# Altium schematic sheet PushButtonRed.SchDoc
size B
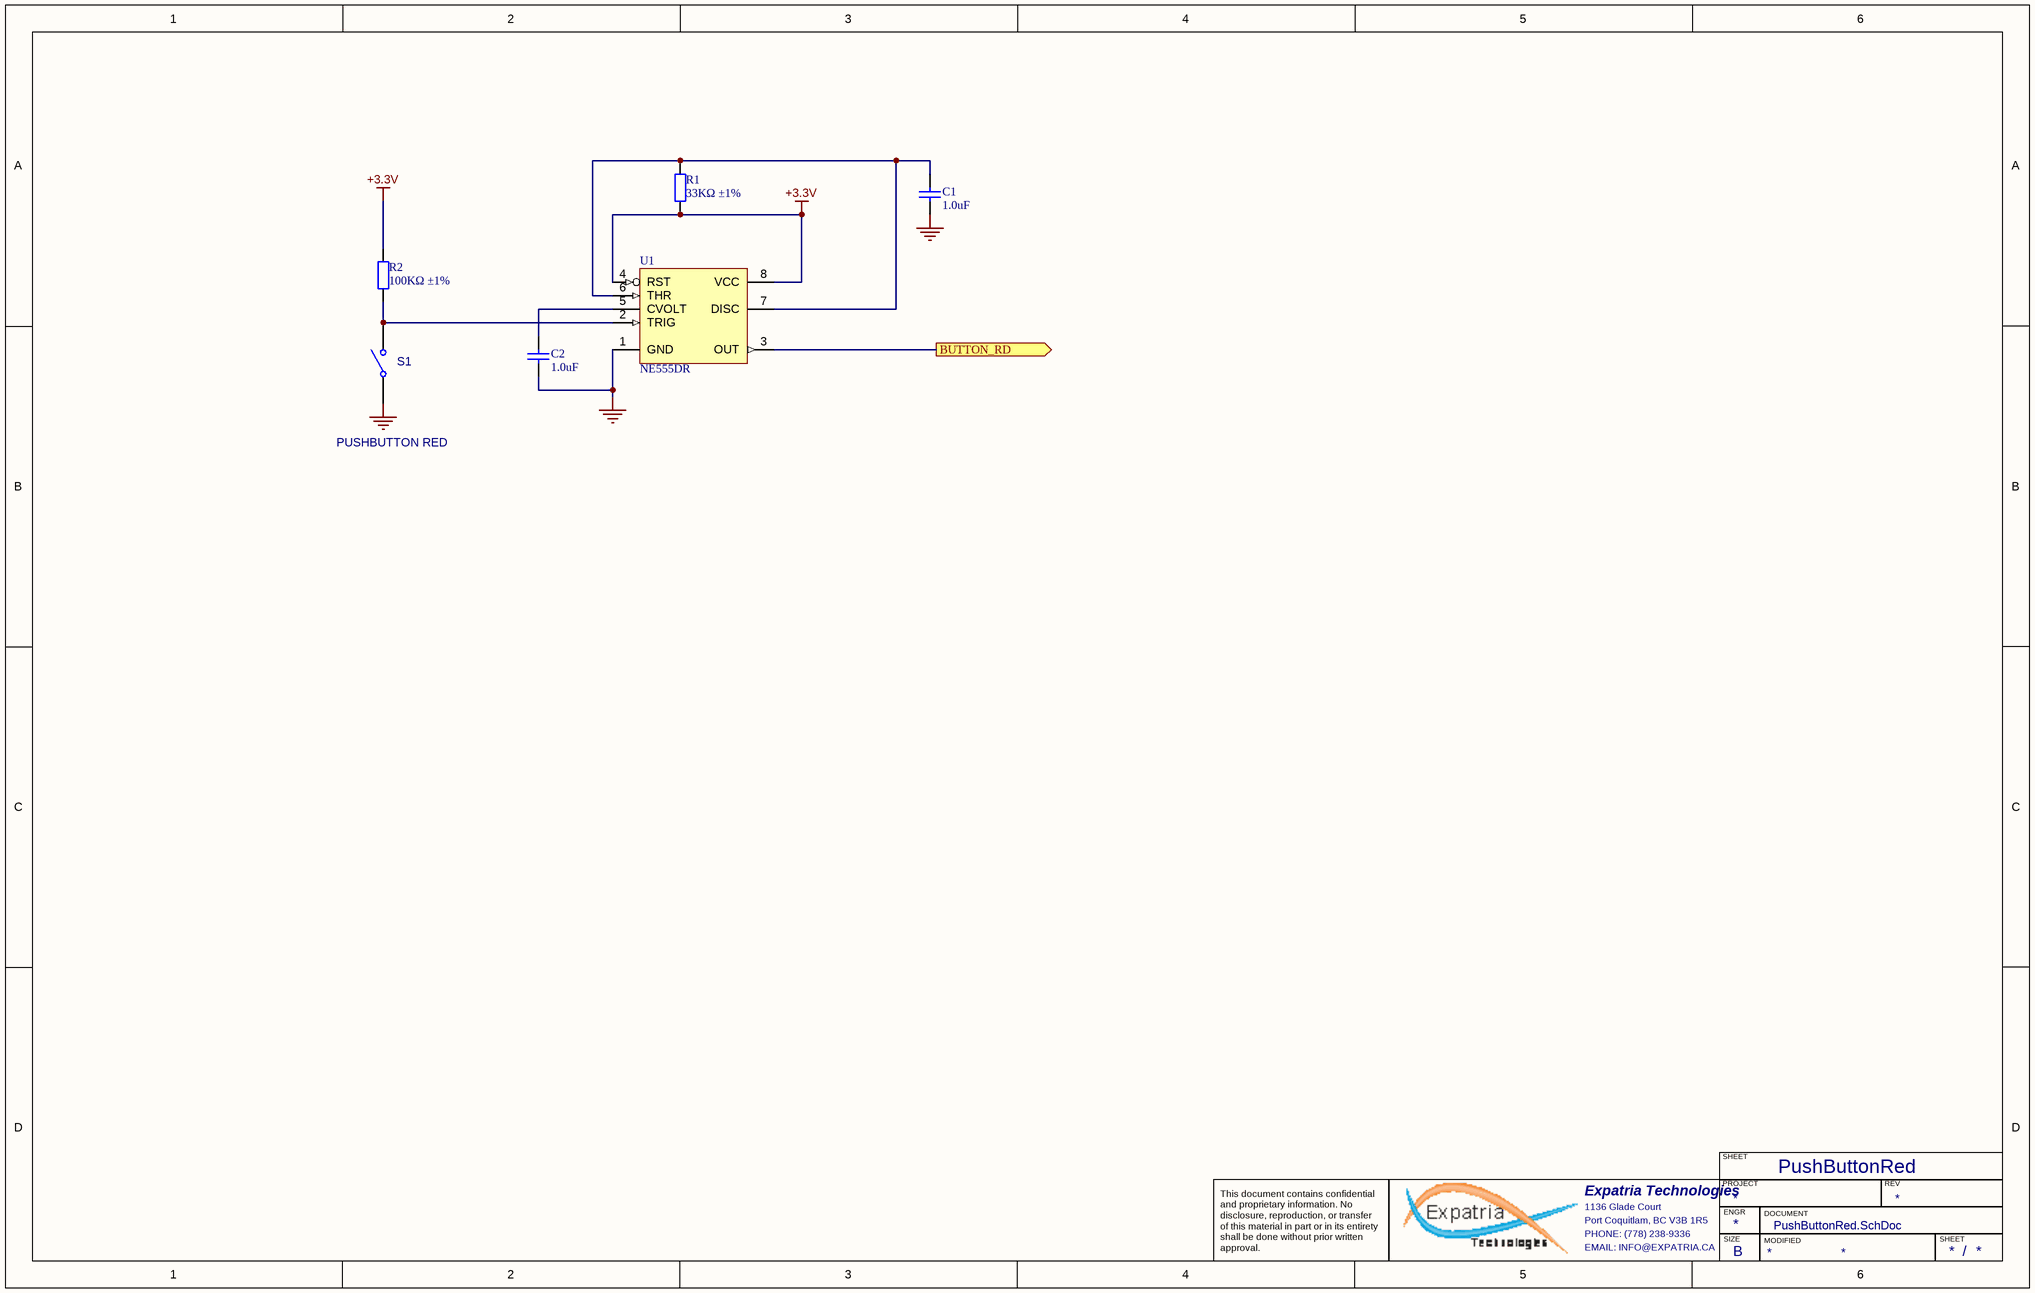
[diagram p0: PushButtonRed.SchDoc]

## Parts
C1  1.0uF  [0402_C]
C2  1.0uF  [0402_C]
R1  33KΩ ±1%  [0402_R]
R2  100KΩ ±1%  [0402_R]
S1  PUSHBUTTON RED  [D6C10F1LFS_RED]
U1  NE555DR  [SOIC-8_150mil]

## Ports
BUTTON_RD (out)

## Nets
+3.3V: R1.1 R2.2 U1.4(RST) U1.8(VCC)
GND: C1.1 C2.2 S1.1(COMMON) U1.1(GND)
BUTTON_RD: U1.3(OUT) ; port BUTTON_RD
NetC1_2: C1.2 R1.2 U1.6(THR) U1.7(DISC)
NetC2_1: C2.1 U1.5(CVOLT)
NetR2_1: R2.1 S1.2(NO) U1.2(TRIG)

## Notes on the sheet
- PushButtonRed
- SHEET
- Expatria Technologies
- 1136 Glade Court
- Port Coquitlam, BC V3B 1R5
- PHONE: (778) 238-9336
- PROJECT
- SIZE
- ENGR
- MODIFIED
- DOCUMENT
- REV
- This document contains confidential and proprietary information. No disclosure, reproduction, or transfer of this material in part or in its entirety shall be done without prior written approval.
- EMAIL: INFO@EXPATRIA.CA
- B
- /

## Library data of the parts
C1 C2 = 0402 1.0uF (105) 10% 25V: Chip capacitor; Manufacturer: Samsung Electro-Mechanics; PartNumber: CL05A105KA5NQNC; Capacitance: 1uF; Tolerance: 10%; Voltage: 25V; ComponentLink1Description: Supplier link; ComponentLink1URL: http://www.szlcsc.com/product/details_53938.html; Package: 0402; Supplier: LC; SuppliersPartNumber: C52923
R1 = 0402 33K (3302) 1%: Chip resistor; Manufacturer: Uniroyal Elec; PartNumber: 0402WGF3302TCE; Power: 1/16W; ComponentLink1Description: Supplier link; ComponentLink1URL: http://www.szlcsc.com/product/details_26522.html; Package: 0402; Supplier: LC; SuppliersPartNumber: C25779; Resistance: 33KΩ; Tolerance: 1%
R2 = 0402 100K (1003) 1%: Chip resistor; Manufacturer: Uniroyal Elec; PartNumber: 0402WGF1003TCE; Power: 1/16W; ComponentLink1Description: Supplier link; ComponentLink1URL: http://www.szlcsc.com/product/details_26484.html; Package: 0402; Supplier: LC; SuppliersPartNumber: C25741; Resistance: 100KΩ; Tolerance: 1%
S1 = D6R40 F1 LFS: SWITCH PUSH SPST-NO 0.1A 32V RED; Manufacturer 1: C&K; Manufacturer Part Number 1: D6R40 F1 LFS; Value: BUTTON RED; Supplier 1: Digi-Key; Supplier Part Number 1: 401-1975-ND
U1 = NE555DR_[C7593]: 时基集成; ComponentLink1Description: 供应商链接; ComponentLink1URL: http://www.szlcsc.com/product/details_8070.html; Package: SOIC-8_150mil; Supplier: LC; SuppliersPartNumber: C7593